# EasyEDA Pro project ProPrj_IoT House_2026-04-28.epro, schematic IoT House Main PCB_2
Board Name: Main_Single_Layer; Create Date: 2026-01-06; Page Name: P1; Project Name: IoT House; Schematic Name: IoT House Main PCB; Update Date: 2026-01-29; Company: EasyEDA.com; Page Size: A4; Version: V1.0
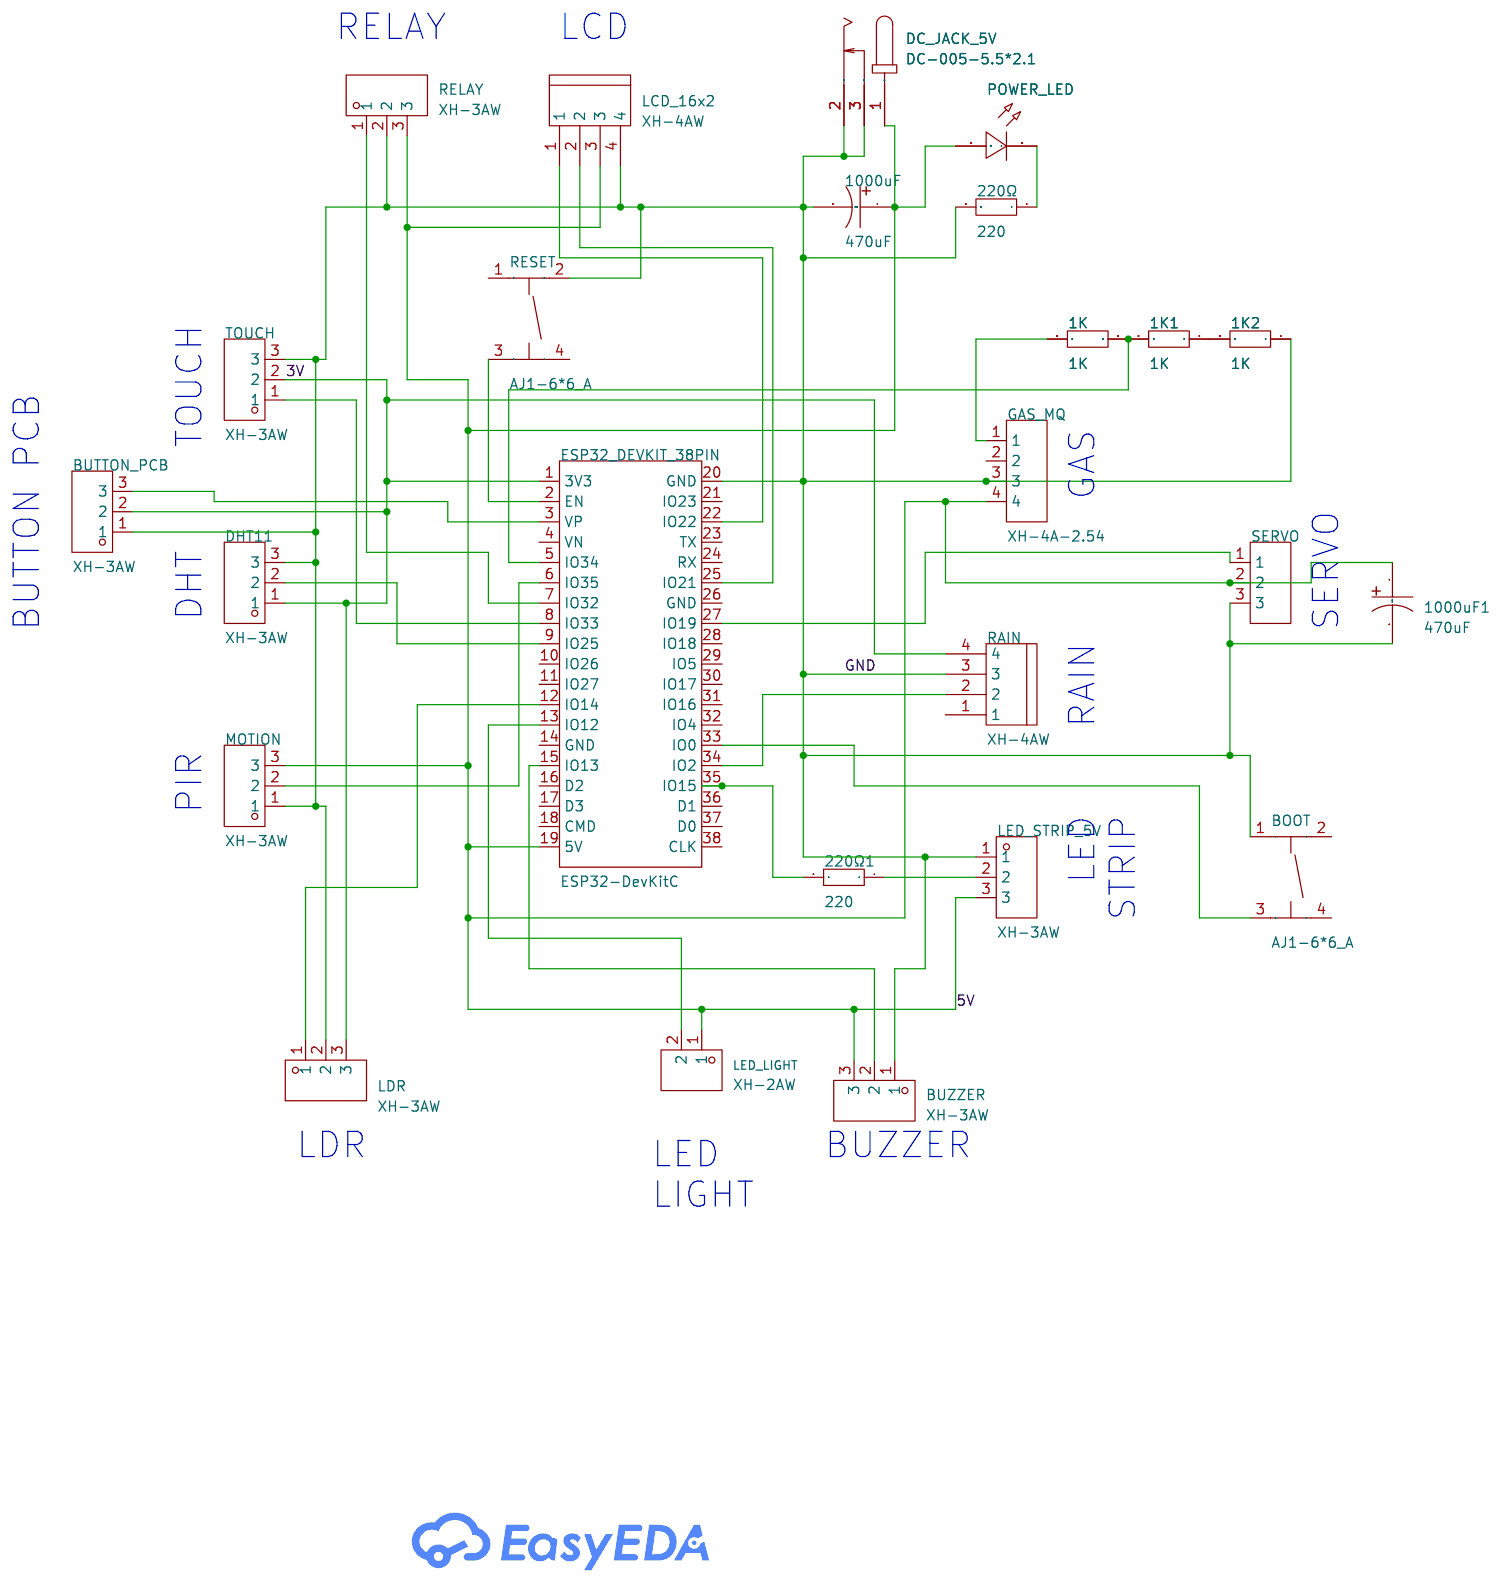
[diagram p2: schematic sheet]

## Parts
1K  1K  [RES-TH_BD1.8-L3.2-P7.20-D0.4]
1K1  1K  [RES-TH_BD1.8-L3.2-P7.20-D0.4]
1K2  1K  [RES-TH_BD1.8-L3.2-P7.20-D0.4]
220Ω  220  [RES-TH_BD1.8-L3.2-P7.20-D0.4]
220Ω1  220  [RES-TH_BD1.8-L3.2-P7.20-D0.4]
1000uF  470uF  [CAP-TH_BD6.3-P6.00-D0.8-FD]
1000uF1  470uF  [CAP-TH_BD6.3-P6.00-D0.8-FD]
BOOT  AJ1-6*6_A  [SW-TH_4P-L6.0-W6.0-P4.50-LS6.5]
BUTTON_PCB  XH-3AW  [CONN-TH_3P-P2.54_HCTL_XH-3AW]
BUZZER  XH-3AW  [CONN-TH_3P-P2.54_HCTL_XH-3AW]
DC_JACK_5V  DC-005-5.5*2.1  [DC-IN-TH_DC-005-2]
DHT11  XH-3AW  [CONN-TH_3P-P2.54_HCTL_XH-3AW]
ESP32_DEVKIT_38PIN  ESP32-DevKitC  [BULETM-SMD_ESP32-DEVKITC]
GAS_MQ  XH-4A-2.54  [CONN-TH_4P-P2.50-XH2.54-4P]
LCD_16x2  XH-4AW  [CONN-TH_4P-P2.50_XH-4AW]
LDR  XH-3AW  [CONN-TH_3P-P2.54_HCTL_XH-3AW]
LED_LIGHT  XH-2AW  [CONN-TH_XH-2AW_C722860]
LED_STRIP_5V  XH-3AW  [CONN-TH_3P-P2.54_HCTL_XH-3AW]
MOTION  XH-3AW  [CONN-TH_3P-P2.54_HCTL_XH-3AW]
POWER_LED  -  [LED-TH_BD5.8-P2.54-FD]
RAIN  XH-4AW  [CONN-TH_4P-P2.50_XH-4AW]
RELAY  XH-3AW  [CONN-TH_3P-P2.54_HCTL_XH-3AW]
RESET  AJ1-6*6_A  [SW-TH_4P-L6.0-W6.0-P4.50-LS6.5]
SERVO  -  [HDR-TH_3P-P2.54-V-M]
TOUCH  XH-3AW  [CONN-TH_3P-P2.54_HCTL_XH-3AW]

## Library data of the parts
1K 1K1 1K2 220Ω 220Ω1 = Res_AXIAL-1/8W: Supplier Footprint: Through
1000uF 1000uF1 = UVR1A471MED1TA: Capacitance: Tolerance:±20% Tolerance:±20% Rated Voltage: Ripple Current:350mA@120Hz Equivalent Series Resistance(ESR):- Lead Spacing:2.5mm φD: L: Lifetime @ Temp:2000hrs@85℃ Operating Temperature:-40℃~+85℃ Operating Temperature:-40℃~+85℃; LCSC Part Name: 470uF ±20% 10V; Supplier Part: C250985; Manufacturer: Nichicon(尼吉康); Supplier Footprint: 插件,D6.3xL11mm; JLCPCB Part Class: Extended Part; Datasheet: https://atta.szlcsc.com/upload/public/pdf/source/20191008/C433303_D573DEDEE220E765C09BA06B45C0AD66.pdf; Supplier: LCSC; Tolerance: ±20%; Ripple Current: 350mA@120Hz; Lead Spacing: 2.5mm; Lifetime @ Temp: 2000hrs@85℃; Operating Temperature: -40℃~+85℃
BOOT RESET = AJ1-6*6_A: Supplier Part: C9900022369; Supplier Footprint: SW-TH; JLCPCB Part Class: Extended Part; Supplier: LCSC
BUTTON_PCB BUZZER DHT11 LDR LED_STRIP_5V MOTION RELAY TOUCH = XH-3AW_C2908612: Pins Structure:1x3P Pitch:2.54mm Mounting Type:Right Angle Reference Series:XH Number of Pins:3P Number of Rows:1 Number of PINs Per Row:3 Row Spacing:- Current Rating:3A Contact Material:Brass Contact Plating:Tin Operating Temperature:-25℃~+85℃ Operating; LCSC Part Name: 1x3P 间距:2.54mm 弯插 系列:XH; Supplier Part: C2908612; Manufacturer: HCTL(华灿天禄); Supplier Footprint: 弯插,P=2.5mm; JLCPCB Part Class: Extended Part; Datasheet: https://item.szlcsc.com/datasheet/XH-3AW/3184383.html; Supplier: LCSC; Pins Structure: 1x3P; Pitch: 2.54mm; Mounting Type: Right Angle; Reference Series: XH; Number of Pins: 3P; Number of Rows: 1; Number of PINs Per Row: 3; Current Rating: 3A; Contact Material: Brass; Contact Plating: Tin; Operating Temperature: -25℃~+85℃; Voltage Rating: 250V; Plastic Material: PA66; Flame Retardant Rating: UL94V-0; Z-Height of the Board: 5.9mm; Y-Width of Bottom Edge on Board: 7mm
DC_JACK_5V = DC-005-5.5*2.1: Supplier Part: C9900017044; Supplier Footprint: DC-005; JLCPCB Part Class: Extended Part; Supplier: LCSC
ESP32_DEVKIT_38PIN = ESP32-DevKitC: CPU:- ROM Size:- Number of I/O: USB:- WIFI Protocols:- Bluetooth:- Ethernet:- Audio & Video Interface:- Multimedia Support:- Card Type:- Power Supply Type:- Power Supply:- POE Support:- Resolution:- Temperature Range:-; LCSC Part Name: 开发板; Supplier Part: C571180; Manufacturer: ESPRESSIF(乐鑫); Datasheet: https://atta.szlcsc.com/upload/public/pdf/source/20200521/C529586_D6FCDAFCFF160B3EDDF7DF28D600699D.pdf; Supplier: LCSC
GAS_MQ = XH-4A-2.54: Supplier Part: C9900009905; Supplier Footprint: CONN-TH; JLCPCB Part Class: Extended Part; Supplier: LCSC
LCD_16x2 RAIN = XH-4AW: LCSC Part Name: XH-4AW 4P，脚距2.5mm，卧插; Supplier Part: C31954; Supplier Footprint: 插件; JLCPCB Part Class: Extended Part; Supplier: LCSC
LED_LIGHT = XH-2AW_C722860: Pins Structure:1x2P Pitch:2.5mm Mounting Type:Right Angle Reference Series:- Number of Pins:2P Number of Rows:1 Number of PINs Per Row:2 Row Spacing:- Current Rating:2A Contact Material:Brass Operating Temperature:-25℃~+85℃ Operating Temperature:-25℃~+85℃; LCSC Part Name: 1x2P 间距:2.5mm 弯插; Supplier Part: C722860; Manufacturer: CAX(创都); Supplier Footprint: 弯插,P=2.5mm; JLCPCB Part Class: Extended Part; Datasheet: https://item.szlcsc.com/datasheet/XH-2AW/767067.html; Supplier: LCSC; Pins Structure: 1x2P; Pitch: 2.5mm; Mounting Type: Right Angle; Number of Pins: 2P; Number of Rows: 1; Number of PINs Per Row: 2; Current Rating: 2A; Contact Material: Brass; Operating Temperature: -25℃~+85℃; Voltage Rating: 250V; Plastic Material: PA66; Z-Height of the Board: 5.8mm; X-Length of Bottom Edge on Board (Spacing Line): 7.5mm; Y-Width of Bottom Edge on Board: 7mm
POWER_LED = LED_TH-R_5mm: Supplier Footprint: Through
SERVO = HDR-M_2.54_1x3P: Supplier Footprint: Through

## Nets
3V: BUTTON_PCB.2 DHT11.1 ESP32_DEVKIT_38PIN.1(3V3) LDR.3 RAIN.4 TOUCH.2
5V: 1000uF.1 1000uF1.1 BUZZER.3 DC_JACK_5V.1 ESP32_DEVKIT_38PIN.19(5V) GAS_MQ.4 LCD_16x2.3 LED_LIGHT.1 LED_STRIP_5V.3 MOTION.3 POWER_LED.1(C) RELAY.3 SERVO.2
GND: 1K2.1 220Ω.2 1000uF.2 1000uF1.2 BOOT.1 BUTTON_PCB.1 BUZZER.1 DC_JACK_5V.2 DC_JACK_5V.3 DHT11.3 ESP32_DEVKIT_38PIN.20(GND) GAS_MQ.3 LCD_16x2.4 LDR.2 LED_STRIP_5V.1 MOTION.1 RAIN.3 RELAY.2 RESET.2 SERVO.3 TOUCH.3
$1N5542: ESP32_DEVKIT_38PIN.7(IO32) RELAY.1
$1N5549: ESP32_DEVKIT_38PIN.8(IO33) TOUCH.1
$1N5561: ESP32_DEVKIT_38PIN.6(IO35) MOTION.2
$1N5570: ESP32_DEVKIT_38PIN.12(IO14) LDR.1
$1N5623: ESP32_DEVKIT_38PIN.25(IO21) LCD_16x2.2
$1N5633: ESP32_DEVKIT_38PIN.22(IO22) LCD_16x2.1
$1N6222: ESP32_DEVKIT_38PIN.2(EN) RESET.3
$1N8401: ESP32_DEVKIT_38PIN.34(IO2) RAIN.2
$1N8544: DHT11.2 ESP32_DEVKIT_38PIN.9(IO25)
$1N8560: ESP32_DEVKIT_38PIN.13(IO12) LED_LIGHT.2
$1N11077: BOOT.3 ESP32_DEVKIT_38PIN.33(IO0)
$1N11911: ESP32_DEVKIT_38PIN.27(IO19) SERVO.1
$1N13992: BUZZER.2 ESP32_DEVKIT_38PIN.15(IO13)
$1N14782: BUTTON_PCB.3 ESP32_DEVKIT_38PIN.3(VP)
Net-(1K1-1): 1K1.1 1K2.2
Net-(1K-1): 1K.1 1K1.2 ESP32_DEVKIT_38PIN.5(IO34)
Net-(1K-2): 1K.2 GAS_MQ.1
Net-(220Ω1-1): 220Ω1.1 LED_STRIP_5V.2
Net-(220Ω1-2): 220Ω1.2 ESP32_DEVKIT_38PIN.35(IO15)
Net-(220Ω-1): 220Ω.1 POWER_LED.2(A)

Not connected (* = marked no-connect by the designer): BOOT 2 4; ESP32_DEVKIT_38PIN 4(VN) 10(IO26) 11(IO27) 14(GND) 16(D2) 17(D3) 18(CMD) 21(IO23) 23(TX) 24(RX) 26(GND) 28(IO18) 29(IO5) 30(IO17) 31(IO16) 32(IO4) 36(D1) 37(D0) 38(CLK); GAS_MQ 2; RAIN 1; RESET 1 4

## Notes on the sheet
- RELAY
- LCD
- GAS
- TOUCH
- SERVO
- BUTTON PCB
- DHT
- RAIN
- PIR
- LED
  STRIP
- LED
  LIGHT
- LDR
- BUZZER
